# Altium schematic sheet Power.SchDoc
size A3
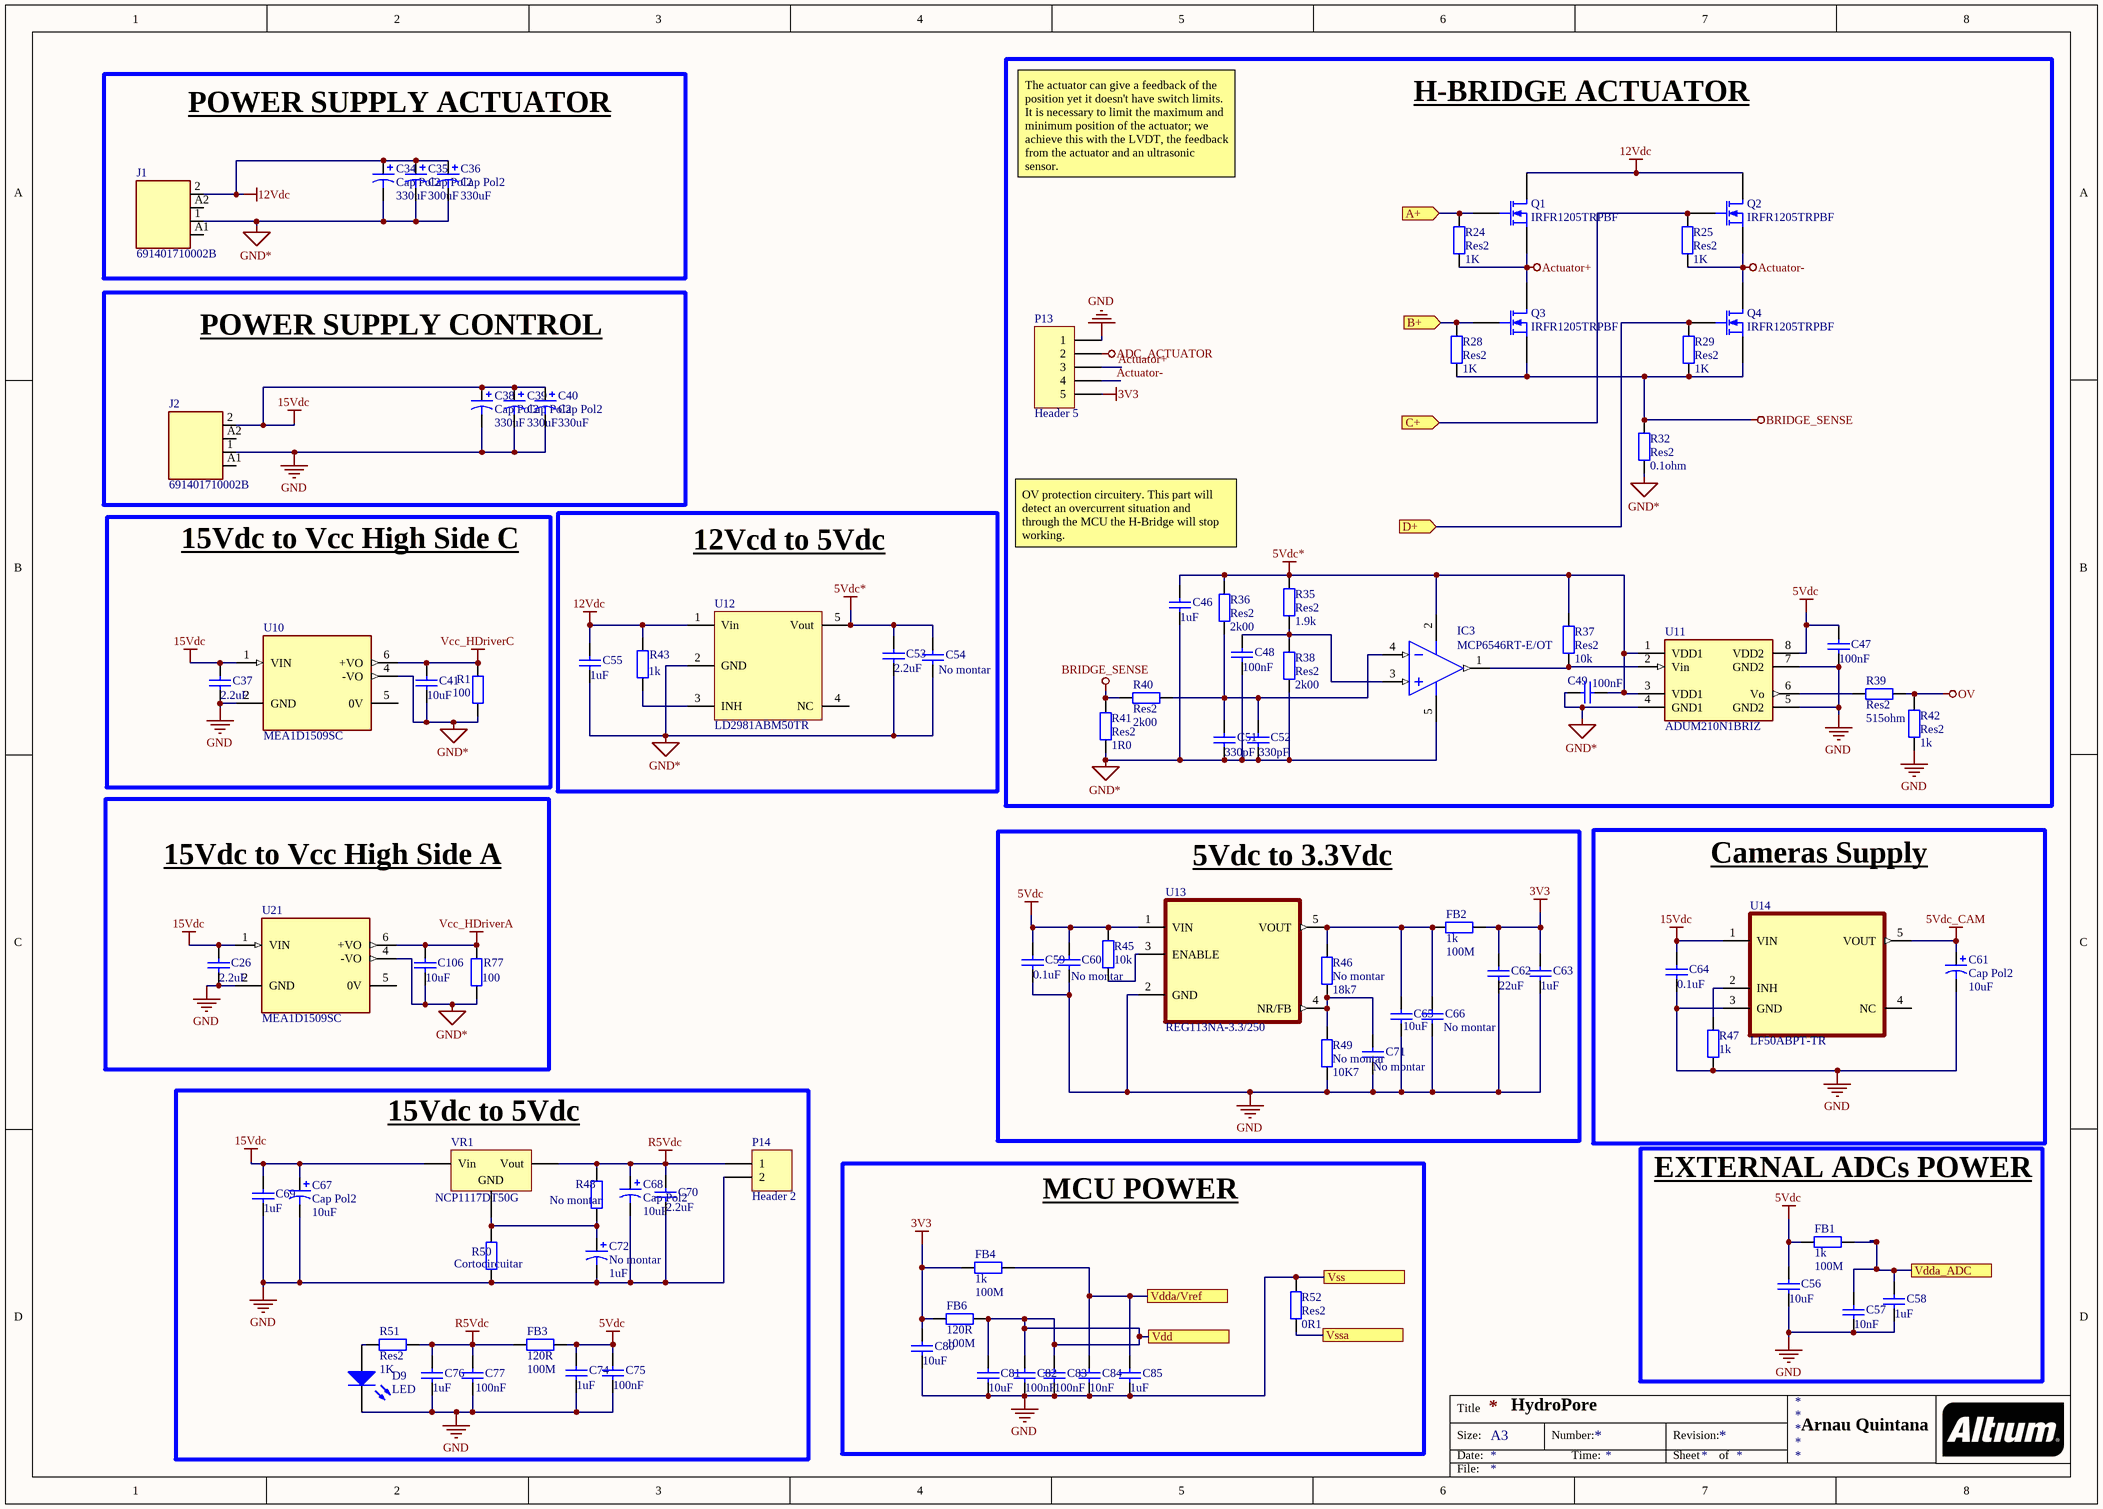
[diagram p0: Power.SchDoc]

## Parts
C26  value 2.2uF  [0603 - duplicate]  (hidden comment: Cap)
C34  Cap Pol2  value 330uF  [ElectrolythicCap_5mm]
C35  Cap Pol2  value 300uF  [ElectrolythicCap_5mm]
C36  Cap Pol2  value 330uF  [ElectrolythicCap_5mm]
C37  value 2.2uF  [0603 - duplicate]  (hidden comment: Cap)
C38  Cap Pol2  value 330uF  [ElectrolythicCap_5mm]
C39  Cap Pol2  value 330uF  [ElectrolythicCap_5mm]
C40  Cap Pol2  value 330uF  [ElectrolythicCap_5mm]
C41  value 10uF  [0603 - duplicate]  (hidden comment: Cap)
C46  value 1uF  [0603 - duplicate]  (hidden comment: Cap)
C47  value 100nF  [0603 - duplicate]  (hidden comment: Cap)
C48  value 100nF  [0603 - duplicate]  (hidden comment: Cap)
C49  value 100nF  [0603 - duplicate]  (hidden comment: Cap)
C51  value 330pF  [0603 - duplicate]  (hidden comment: Cap)
C52  value 330pF  [0603 - duplicate]  (hidden comment: Cap)
C53  value 2.2uF  [0603 - duplicate]  (hidden comment: Cap)
C54  No montar  [0603 - duplicate]
C55  value 1uF  [0603 - duplicate]  (hidden comment: Cap)
C56  value 10uF  [0603 - duplicate]  (hidden comment: Cap)
C57  value 10nF  [0603 - duplicate]  (hidden comment: Cap)
C58  value 1uF  [0603 - duplicate]  (hidden comment: Cap)
C59  value 0.1uF  [0603 - duplicate]  (hidden comment: Cap)
C60  No montar  [0603 - duplicate]
C61  Cap Pol2  value 10uF  [ElectrolythicCap_2mm]
C62  value 22uF  [0603 - duplicate]  (hidden comment: Cap)
C63  value 1uF  [0603 - duplicate]  (hidden comment: Cap)
C64  value 0.1uF  [0603 - duplicate]  (hidden comment: Cap)
C65  10uF  [0603 - duplicate]
C66  No montar  [0603 - duplicate]
C67  Cap Pol2  value 10uF  [ElectrolythicCap_2mm]
C68  Cap Pol2  value 10uF  [ElectrolythicCap_2mm]
C69  value 1uF  [0603 - duplicate]  (hidden comment: Cap)
C70  value 2.2uF  [0603 - duplicate]  (hidden comment: Cap)
C71  value No montar  [0603 - duplicate]  (hidden comment: 0.01uF)
C72  No montar  value 1uF  [ElectrolythicCap_2mm]
C74  value 1uF  [0603 - duplicate]  (hidden comment: Cap)
C75  value 100nF  [0603 - duplicate]  (hidden comment: Cap)
C76  value 1uF  [0603 - duplicate]  (hidden comment: Cap)
C77  value 100nF  [0603 - duplicate]  (hidden comment: Cap)
C80  value 10uF  [0603 - duplicate]  (hidden comment: Cap)
C81  value 10uF  [0603 - duplicate]  (hidden comment: Cap)
C82  value 100nF  [0603 - duplicate]  (hidden comment: Cap)
C83  value 100nF  [0603 - duplicate]  (hidden comment: Cap)
C84  value 10nF  [0603 - duplicate]  (hidden comment: Cap)
C85  value 1uF  [0603 - duplicate]  (hidden comment: Cap)
C106  value 10uF  [0603 - duplicate]  (hidden comment: Cap)
D9  LED  [LED 1206]
FB1  1k  value 100M  [0603 - duplicate]
FB2  1k  value 100M  [0603 - duplicate]
FB3  120R  value 100M  [0603 - duplicate]
FB4  1k  value 100M  [0603 - duplicate]
FB6  120R  value 100M  [0603 - duplicate]
IC3  MCP6546RT-E/OT  [SOT23-5_N]
J1  691401710002B  [691401710002B]
J2  691401710002B  [691401710002B]
P13  Header 5  [regleta_5]
P14  Header 2  [HDR1X2]
Q1  IRFR1205TRPBF  [Infineon_PG-TO252-3_MFG]
Q2  IRFR1205TRPBF  [Infineon_PG-TO252-3_MFG]
Q3  IRFR1205TRPBF  [Infineon_PG-TO252-3_MFG]
Q4  IRFR1205TRPBF  [Infineon_PG-TO252-3_MFG]
R1  100  [1206]
R24  Res2  value 1K  [0603 - duplicate]
R25  Res2  value 1K  [0603 - duplicate]
R28  Res2  value 1K  [0603 - duplicate]
R29  Res2  value 1K  [0603 - duplicate]
R32  Res2  value 0.1ohm  [1206]
R35  Res2  value 1.9k  [0603 - duplicate]
R36  Res2  value 2k00  [0603 - duplicate]
R37  Res2  value 10k  [0603 - duplicate]
R38  Res2  value 2k00  [0603 - duplicate]
R39  Res2  value 515ohm  [0603 - duplicate]
R40  Res2  value 2k00  [0603 - duplicate]
R41  Res2  value 1R0  [1206]
R42  Res2  value 1k  [0603 - duplicate]
R43  1k  [0603 - duplicate]
R45  10k  [0603 - duplicate]
R46  No montar  value 18k7  [0603 - duplicate]
R47  1k  [0603 - duplicate]
R48  No montar  [0603 - duplicate]
R49  No montar  value 10K7  [0603 - duplicate]
R50  Cortocircuitar  [0603 - duplicate]
R51  Res2  value 1K  [0603 - duplicate]
R52  Res2  value 0R1  [0603 - duplicate]
R77  100  [1206]
U10  MEA1D1509SC  [CONV_MEA1D1509SC]
U11  ADUM210N1BRIZ  [SOIC127P1031X265-8N]
U12  LD2981ABM50TR  [SOT23-5_N]
U13  REG113NA-3.3/250  [SOT23-5_N]
U14  LF50ABPT-TR  [DPAK114P990X239-6N]
U21  MEA1D1509SC  [CONV_MEA1D1509SC]
VR1  NCP1117DT50G  [D2PAK_N]

## Blocks framed on the sheet
H-BRIDGE ACTUATOR: C46-C49 C51 C52 IC3 P13 Q1-Q4 R24 R25 R28 R29 R32 R35-R42 U11
POWER SUPPLY ACTUATOR: C34-C36 J1
POWER SUPPLY CONTROL: C38-C40 J2
15Vdc to Vcc High Side C: C37 C41 R1 U10
12Vcd to 5Vdc: C53-C55 R43 U12
15Vdc to Vcc High Side A: C26 C106 R77 U21
5Vdc to 3.3Vdc: C59 C60 C62 C63 C65 C66 C71 FB2 R45 R46 R49 U13
Cameras Supply: C61 C64 R47 U14
15Vdc to 5Vdc: C67-C70 C72 C74-C77 D9 FB3 P14 R48 R50 R51 VR1
EXTERNAL ADCs POWER: C56-C58 FB1
MCU POWER: C80-C85 FB4 FB6 R52

## Ports
A+ (in), B+ (in), C+ (in), D+ (in), Vdd, Vdda/Vref, Vdda_ADC, Vss, Vssa

## Nets
3V3: C62.2 C63.2 C80.2 FB2.2 FB4.1 FB6.1 P13.5
5Vdc: C47.2 C56.2 C59.2 C60.2 C74.2 C75.2 FB1.1 FB3.2 R45.2 U11.8(VDD2) U13.1(VIN)
5Vdc*: C46.2 C49.1 C53.2 C54.2 IC3.2(V+) R35.1 R36.1 R37.2 U11.1(VDD1) U11.3(VDD1) U12.5(Vout)
5Vdc_CAM: C61.P U14.5(VOUT)
12Vdc: C34.P C35.P C36.P C55.2 J1.2 Q1.2(D) Q2.2(D) R43.2 U12.1(Vin)
15Vdc: C26.2 C37.2 C38.P C39.P C40.P C64.2 C67.P C69.2 J2.2 U10.1(VIN) U14.1(VIN) U21.1(VIN) VR1.3(Vin)
Actuator+: P13.3 Q1.3(S) Q3.2(D) R24.1
Actuator-: P13.4 Q2.3(S) Q4.2(D) R25.1
ADC_ACTUATOR: P13.2
BRIDGE_SENSE: Q3.3(S) Q4.3(S) R28.1 R29.1 R32.2 R40.1 R41.2
GND: C26.1 C37.1 C38.N C39.N C40.N C47.1 C56.1 C57.1 C58.1 C59.1 C60.1 C61.N C62.1 C63.1 C64.1 C65.1 C66.1 C67.N C68.N C69.1 C70.1 C71.1 C72.N C74.1 C75.1 C76.1 C77.1 C80.1 C81.1 C82.1 C83.1 C84.1 C85.1 D9.2(K) J2.1 P13.1 P14.2 R42.2 R47.1 R49.1 R50.1 R52.2 U10.2(GND) U11.5(GND2) U11.7(GND2) U13.2(GND) U14.3(GND) U21.2(GND) ; port Vss
GND*: C34.N C35.N C36.N C41.1 C46.1 C48.1 C49.2 C51.1 C52.1 C53.1 C54.1 C55.1 C106.1 IC3.5(V-) J1.1 R1.1 R32.1 R38.2 R41.1 R77.1 U10.4(-VO) U11.4(GND1) U12.2(GND) U21.4(-VO)
OV: R39.1 R42.1
R5Vdc: C68.P C70.2 C76.2 C77.2 FB3.1 P14.1 R48.2 R51.2 VR1.2(Vout)
Vcc_HDriverA: C106.2 R77.2 U21.6(+VO)
Vcc_HDriverC: C41.2 R1.2 U10.6(+VO)
A+: Q1.1(G) R24.2 ; port A+
B+: Q3.1(G) R28.2 ; port B+
C+: Q2.1(G) R25.2 ; port C+
D+: Q4.1(G) R29.2 ; port D+
Vdd: C81.2 C82.2 C83.2 FB6.2 ; port Vdd
Vdda/Vref: C84.2 C85.2 FB4.2 ; port Vdda/Vref
Vdda_ADC: C57.2 C58.2 FB1.2 ; port Vdda_ADC
Vssa: R52.1 ; port Vssa
NetC48_2: C48.2 IC3.3(IN+) R35.2 R38.1
NetC51_2: C51.2 C52.2 IC3.4(IN-) R36.2 R40.2
NetC65_2: C65.2 C66.2 FB2.1 R46.2 U13.5(VOUT)
NetC71_2: C71.2 R46.1 R49.2 U13.4(NR/FB)
NetC72_P: C72.P R48.1 R50.2 VR1.1(GND)
NetD9_1: D9.1(A) R51.1
NetIC3_1: IC3.1(OUT) R37.1 U11.2(Vin)
NetR39_2: R39.2 U11.6(Vo)
NetR43_1: R43.1 U12.3(INH)
NetR45_1: R45.1 U13.3(ENABLE)
NetR47_2: R47.2 U14.2(INH)

Not connected (* = marked no-connect by the designer): J1 A1(2) A2(1); J2 A1(2) A2(1); U10 5(0V); U12 4(NC); U14 4(NC); U21 5(0V)

## Notes on the sheet
- The actuator can give a feedback of the position yet it doesn't have switch limits. It is necessary to limit the maximum and minimum position of the actuator; we achieve this with the LVDT, the feedback from the actuator and an ultrasonic sensor.
- OV protection circuitery. This part will detect an overcurrent situation and through the MCU the H-Bridge will stop working.
- (near U14) Cameras use their own LDO, every one of them have a consume of 100mA more less, so just for ensure a correct working we separate supplies.
- (near FB4) MCU is a critical component, before connect the 3.3V supply we need to filter and ensure that uC will not be without supply in any moment using a good number of capacitors.
- HydroPore
- Arnau Quintana
- Title
- Size:
- Date:
- A3
- Number:
- Time:
- Revision:
- Sheet
- of
- File:

## Library data of the parts
C26 C37 C41 C46-C49 C51-C60 C62-C66 C69-C71 C74-C77 C80-C85 C106 = Cap: Capacitor; Published: 8-Jun-2000; LatestRevisionDate: 17-Jul-2002; LatestRevisionNote: Re-released for DXP Platform.; PackageReference: RAD-0.3; Publisher: Altium Limited; PackageDescription: Radial Cap, Thru-Hole; 2 Leads; 0.3 in Pin Spacing
C34-C36 C38-C40 C61 C67 C68 C72 = Cap Pol2: Polarized Capacitor (Axial); Published: 8-Jun-2000; LatestRevisionDate: 17-Jul-2002; LatestRevisionNote: Re-released for DXP Platform.; PackageReference: POLAR0.8; Publisher: Altium Limited; PackageDescription: Polarized Capacitor; 2 Leads
D9 = LED: Typical RED, GREEN, YELLOW, AMBER GaAs LED; Published: 8-Jun-2000; LatestRevisionDate: 17-Jul-2002; LatestRevisionNote: Re-released for DXP Platform.; PackageVersion: Feb-2002; PackageReference: 3.2X1.6X1.1; Publisher: Altium Limited; PackageDescription: SM LED; 2 Flat Leads
FB1-FB4 FB6 R1 R24 R25 R28 R29 R32 R35-R43 R45-R52 R77 = Res2: Resistor; Published: 8-Jun-2000; LatestRevisionDate: 17-Jul-2002; LatestRevisionNote: Re-released for DXP Platform.; PackageReference: AXIAL-0.4; Publisher: Altium Limited; PackageDescription: Axial Device, Thru-Hole; 2 Leads; 0.4 in Pin Spacing
IC3 = MCP6546RT-E/OT: Operational Amplifier; Published: 8-Jun-2000; LatestRevisionDate: 17-Jul-2002; LatestRevisionNote: Re-released for DXP Platform.; DatasheetVersion: REV. B; PackageVersion: 1990; PackageReference: H-08A; Publisher: Altium Limited; PackageDescription: Can; 8 Leads; Pin Circle Dia. 5.08 mm; Lead Dia. 0.53 mm (max); ComponentLink1Description: Manufacturer Link; ComponentLink1URL: http://www.analog.com/
J1 J2 = 691401710002B: <b>WR-TBL Terminal block - serie 401 5,0mm - Spring clamp/Screw less - horizontal entry ; </b>=>Code : Con_TBL_Screwless_5.00_6914017100xxB <p><a href="http://katalog.we-online.de/media/images/eican/Con_TBL_Screwless_5.00_6914017100xxB_pf2.jpg"> <img src="http://katalog.we-online.de/media/thumbs2/eican/thb_Con_TBL_Screwless_5.00_6914017100xxB_pf2.jpg" width="320"></a><p> <p>Details see: <a href="http://katalog.we-online.de/en/em/TBL_5_00_401B_SCREWLESS_HORIZONTAL_ENTRY_2_0MM2_WIRES_6914017100XXB">http://katalog.we-online.de/en/em/TBL_5_00_401B_SCREWLESS_HORIZONTAL_ENTRY_2_0MM2_WIRES_6914017100XXB</a> <p>Created 11/27/2014, Karrer Zheng <p>2014 (C) Wurth Elektronik; MF: WÃ¼rth Elektronik; Package: None; Value: *; Purchase-URL: https://pricing.snapeda.com/search/part/691401710002B/?ref=eda; Availability: In Stock; SnapEDA_Link: https://www.snapeda.com/parts/691401710002B/Wurth+Electronics+Inc./view-part/?ref=snap; Price: None; MP: 691401710002B; Check_prices: https://www.snapeda.com/parts/691401710002B/Wurth+Electronics+Inc./view-part/?ref=eda
P13 = Header 5: Header, 5-Pin; LatestRevisionDate: 17-Jul-2002; LatestRevisionNote: Re-released for DXP Platform.; Publisher: Altium Limited
P14 = Header 2: Header, 2-Pin; LatestRevisionDate: 17-Jul-2002; LatestRevisionNote: Re-released for DXP Platform.; Publisher: Altium Limited
Q1-Q4 = IRFR1205TRPBF: N-Channel MOSFET; Published: 8-Jun-2000; LatestRevisionDate: 17-Jul-2002; LatestRevisionNote: Re-released for DXP Platform.; PackageVersion: 1995/1996; PackageReference: E3; Publisher: Altium Limited; PackageDescription: TO, Flat Index; 3 In-Line, Axial Leads; Body Dia. 4.6mm; Lead Dia. 0.5 mm (max)
U10 U21 = MEA1D1509SC: 1 W, Dual Independent Output, 7 Pin SIP, 4200 Vdc Isolation, Dc-Dc Converter; MP: VQA-S15-D15-SIP; MF: CUI Inc.; Mouser-Purchase-URL: https://snapeda.com/shop?store=Mouser&id=1237682; Price: None; SnapEDA_Link: https://www.snapeda.com/parts/VQA-S15-D15-SIP/CUI/view-part/1237682/?ref=snap; Availability: Bad; Arrow_Electronics-Purchase-URL: https://snapeda.com/shop?store=Arrow+Electronics&id=1237682; Value: *; CUI_purchase_URL: https://www.cui.com/product/dc-dc-converters/igbt-driver/vqa-series?utm_source=snapeda.com&utm_medium=referral&utm_campaign=snapedaBOM; Package: SIP-7 CUI
U11 = ADUM210N1BRIZ: Digital Isolator; MP: PEME2-S15-D5-S; MF: CUI; Purchase-URL: https://pricing.snapeda.com/search/part/PEME2-S15-D5-S/?ref=eda; Package: None; Value: *; SnapEDA_Link: https://www.snapeda.com/parts/PEME2-S15-D5-S/CUI/view-part/?ref=snap; Availability: In Stock; Price: None; Check_prices: https://www.snapeda.com/parts/PEME2-S15-D5-S/CUI/view-part/?ref=eda
U13 = REG113NA-3.3/250: Dropout Linear  Regulator; MP: LP3964EMP-ADJ; Package: None; Price: None; Value: *; Availability: Unavailable
U14 = LF50ABPT-TR: Dropout Linear  Regulator; MP: LP3964EMP-ADJ; Package: None; Price: None; Value: *; Availability: Unavailable
VR1 = Volt Reg: Published: 24-Mar-1999; LatestRevisionDate: 29-May-2009; LatestRevisionNote: IPC-7351 Footprint Added.; PackageReference: D2PAK; Publisher: Altium Limited; PackageDescription: 3-Pin Transistor Outline Package 2.54 mm Pitch, 15.1 mm Lead Span
U12 = LD2981ABM50TR: Published: 8-Jun-2000; LatestRevisionDate: 29-May-2009; LatestRevisionNote: IPC-7351 Footprint Added.; PackageVersion: May-1999; PackageReference: DB008; Publisher: Altium Limited; PackageDescription: 8-Pin Plastic Small Outline Package 0.65 mm Pitch; Code_JEDEC: MO-150-AA; Code_IPC: SOP65P780-8